# Altium schematic sheet power.SchDoc: Power Supply
size A4
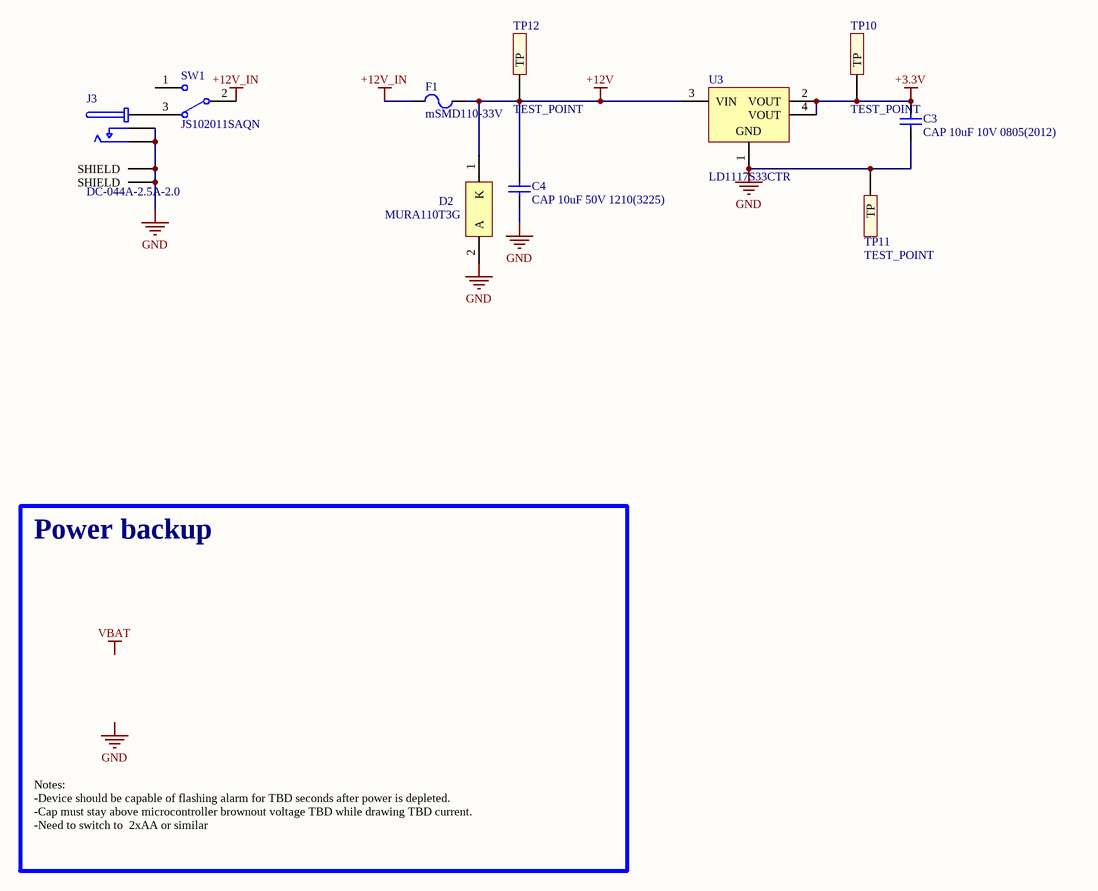
[diagram p0: power.SchDoc]

## Parts
C3  CAP 10uF 10V 0805(2012)  [CAPC0805(2012)145_N]
C4  CAP 10uF 50V 1210(3225)  [CAPC1210(3225)190_N]
D2  MURA110T3G  [ONSC-SMA-2-403D-02_V]
F1  mSMD110-33V  [SEAANDLAND_1812]
J3  DC-044A-2.5A-2.0  [DC-044A-2.5A-2.0]
SW1  JS102011SAQN  [CKCP-JS102011SAQN-3_V]
TP10  TEST_POINT  [TP-SMD-1mm]  (no BOM)
TP11  TEST_POINT  [TP-SMD-1mm]  (no BOM)
TP12  TEST_POINT  [TP-SMD-1mm]  (no BOM)
U3  LD1117S33CTR  [SOT-223_N]

## Nets
+3.3V: C3.2 TP10.1(TP) U3.2(VOUT) U3.4(VOUT)
+12V: C4.2 D2.1(K) F1.2 TP12.1(TP) U3.3(VIN)
+12V_IN: F1.1 SW1.2
GND: C3.1 C4.1 D2.2(A) J3.2 J3.3 J3.4(SHIELD) J3.5(SHIELD) TP11.1(TP) U3.1(GND)
NetJ3_1: J3.1 SW1.3

Not connected (* = marked no-connect by the designer): SW1 1

## Notes on the sheet
- Power backup
- Notes:
  -Device should be capable of flashing alarm for TBD seconds after power is depleted.
  -Cap must stay above microcontroller brownout voltage TBD while drawing TBD current.
  -Need to switch to  2xAA or similar
- Labels drawn without touching a wire or pin: GND, VBAT
- Title:
- Project:
- Revision:
- Date:
- Time:
- Sheet
- of

## Library data of the parts
C3 = CMP-1036-04922-1: CAP 10uF 10V ±10% 0805 (2012 Metric) Thickness 1.45mm SMD; Tolerance: Â±10%; Case-EIA: 0805; Case-Metric: 2012; Value: 10uF; Technology: SMT; Rated Voltage: 10 V; Max Thickness: 1.45 mm
C4 = CMP-1038-02238-1: CAP 10uF 50V -20% to +80% 1210 (3225 Metric) Thickness 1.9mm SMD; Case-Metric: 3225; Case-EIA: 1210; Rated Voltage: 50 V; Tolerance: -20% to +80%; Technology: SMT; Value: 10uF; Max Thickness: 1.9 mm
D2 = CMP-0902-00293-1: Surface Mount Ultrafast Power Rectifier, 2-Pin SMA, Pb-Free, Tape and Reel; Manufacturer: On Semiconductor; IFSM Max (A): 50; Type: Ultrafast; PackageReference: SMA-2-403D-02; ComponentLink3URL: http://www.onsemi.com/pub_link/Collateral/403D-02.PDF; PackageDescription: 2-Pin Small Molded Package, J-Bend Lead, Body 2.605 x 4.315 mm; ComponentLink3Description: Package Specification; PartNumber: MURA110T3G; Mounting Technology: Surface Mount; RoHS: TRUE; DatasheetVersion: Rev. 5; ComponentLink1URL: http://www.onsemi.com/; Packing: Tape and Reel; ComponentLink1Description: Manufacturer URL; ComponentLink2Description: Datasheet; PackageVersion: Rev. G, 07/2012; ComponentLink2URL: http://www.onsemi.cn/pub_link/Collateral/MURA105T3-D.PDF
F1 = mSMD110-33V: Surface Mount Fuses 33V 100A 1.1A 2.2A 1812 RoHS; Manufacturer: Sea & Land Electronic Corp; PartNumber: mSMD110-33V; ComponentLink2Description: Datasheet; ComponentLink2URL: nSMD020-30V 0-2A-30V-Self-healing-fuse_C69680.pdf
J3 = DC-044A-2.5A-2.0: DC Jack, 6mm OD, 2mm ID; Manufacturer: XKB; PartNumber: DC-044A-2.5A-2.0
SW1 = CMP-2000-06501-1: Sub-Miniature Slide Switch, SPDT, -40 to 85 degC, 3-Pin SMD, RoHS, Tape and Reel; Manufacturer: C&K Components; Electrical Life: 15000Cycles; Actuator Color: Black; Body Orientation: RightAngle; Minimum Insulation Resistance: 100MOhm; Contact Rating @ Voltage: 0.3@6VDCA; Actuator Style: SideSlide; Maximum DC Voltage Rating: 6V; COO: US; Actuator Material: Nylon4/6; Dielectric Strength: 500VAC; Maximum Contact Resistance: 70mOhm; Base Material: N/A; Mounting Technology: SurfaceMount; Switch Configuration: N/A; Package Reference: SMT; Package Description: 3-Pin Surface Mount Device, Body 9 x 3.6 mm, Height 3.5 mm; Mounting: SurfaceMount,GullWing; Part No: JS102011SAQN; Dimension: 9x4.3mm; Type: Sub-Miniature; Product Weight: N/A; Seal Location: N/A; Family: JS; ECCN: EAR99; Supplier: C&KComponents; Seal Description: N/A; Contact Plating: Silver; Pole Throw Configuration: SPDT; Packaging: TapeandReel; Manufacturer URL: http://www.ckswitches.com/; Datasheet URL: https://datasheet.ciiva.com/1532/js-9dec14-1532400.pdf; Maximum AC Voltage Rating: N/A; Mechanical Life: N/A; HTS: 8536509050; Datasheet Version: 12/2014; Housing Material: Nylon4/6; Contact Material: CopperAlloy; RoHS: Yes; Operating Temperature: -40to85C
TP10-TP12 = TEST_POINT: Test point
U3 = CMP-0244-00307-1: Fixed Low Drop Positive Voltage Regulator, 3.3V, 4-Pin SOT-223, Tape and Reel; ComponentLink1URL: http://www.st.com; PackageVersion: 2010; ComponentLink1Description: Manufacturer URL; DatasheetVersion: 1/11/2011; ComponentLink2URL: http://www.st.com/internet/com/TECHNICAL_RESOURCES/TECHNICAL_LITERATURE/DATASHEET/CD00000544.pdf; PackageReference: SOT-223; ComponentLink2Description: Datasheet; PackageDescription: 4-Pin SOT-223 Package, 6.5 x 3.5 mm Body, 2.3 mm Pitch, 7 mm Lead Span